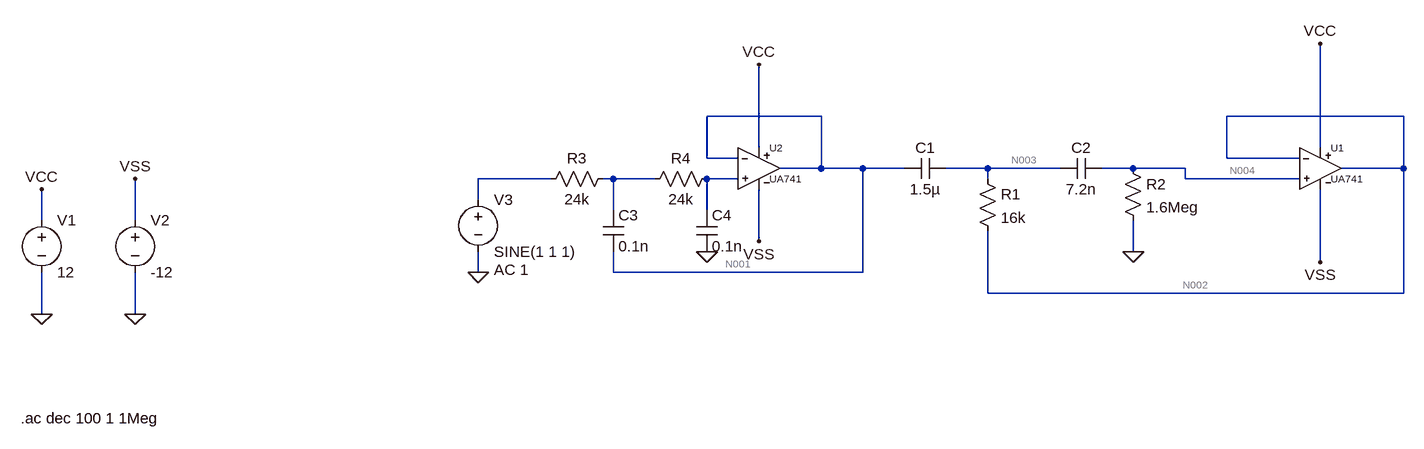
[diagram p0: schematic Filter Stage.asc]
Filter Stage.asc, the LTspice schematic file:
Version 4.1
SHEET 1 1268 680
WIRE 112 48 -64 48
WIRE 1008 48 736 48
WIRE 16 96 16 -32
WIRE 880 96 880 -64
WIRE -64 112 -64 48
WIRE -16 112 -64 112
WIRE 736 112 736 48
WIRE 848 112 736 112
WIRE 112 128 112 48
WIRE 112 128 48 128
WIRE 176 128 112 128
WIRE 240 128 176 128
WIRE 368 128 304 128
WIRE 480 128 368 128
WIRE 592 128 544 128
WIRE 672 128 592 128
WIRE 1008 128 1008 48
WIRE 1008 128 912 128
WIRE -304 144 -416 144
WIRE -208 144 -224 144
WIRE -144 144 -208 144
WIRE -16 144 -64 144
WIRE 368 144 368 128
WIRE 672 144 672 128
WIRE 848 144 672 144
WIRE -416 176 -416 144
WIRE -208 192 -208 144
WIRE -64 192 -64 144
WIRE -1088 208 -1088 160
WIRE -944 208 -944 144
WIRE 16 240 16 160
WIRE 592 256 592 208
WIRE 880 272 880 160
WIRE -416 288 -416 256
WIRE -208 288 -208 256
WIRE 176 288 176 128
WIRE 176 288 -208 288
WIRE 368 320 368 224
WIRE 1008 320 1008 128
WIRE 1008 320 368 320
WIRE -1088 352 -1088 288
WIRE -944 352 -944 288
FLAG -1088 352 0
FLAG -944 352 0
FLAG -1088 160 VCC
FLAG -944 144 VSS
FLAG -416 288 0
FLAG 16 -32 VCC
FLAG 16 240 VSS
FLAG -64 256 0
FLAG 592 256 0
FLAG 880 -64 VCC
FLAG 880 272 VSS
SYMBOL voltage -1088 192 R0
SYMATTR InstName V1
SYMATTR Value 12
SYMBOL voltage -944 192 R0
SYMATTR InstName V2
SYMATTR Value -12
SYMBOL voltage -416 160 R0
WINDOW 123 24 124 Left 2
WINDOW 39 0 0 Left 0
SYMATTR Value2 AC 1
SYMATTR InstName V3
SYMATTR Value SINE(1 1 1)
SYMBOL res -208 128 R90
WINDOW 0 0 56 VBottom 2
WINDOW 3 32 56 VTop 2
SYMATTR InstName R3
SYMATTR Value 24k
SYMBOL cap -224 192 R0
SYMATTR InstName C3
SYMATTR Value 0.1n
SYMBOL res -48 128 R90
WINDOW 0 0 56 VBottom 2
WINDOW 3 32 56 VTop 2
SYMATTR InstName R4
SYMATTR Value 24k
SYMBOL cap -80 192 R0
SYMATTR InstName C4
SYMATTR Value 0.1n
SYMBOL cap 304 112 R90
WINDOW 0 0 32 VBottom 2
WINDOW 3 32 32 VTop 2
SYMATTR InstName C1
SYMATTR Value 1.5µ
SYMBOL cap 544 112 R90
WINDOW 0 0 32 VBottom 2
WINDOW 3 32 32 VTop 2
SYMATTR InstName C2
SYMATTR Value 7.2n
SYMBOL res 352 128 R0
SYMATTR InstName R1
SYMATTR Value 16k
SYMBOL res 576 112 R0
SYMATTR InstName R2
SYMATTR Value 1.6Meg
SYMBOL UA741 208 160 R0
SYMATTR InstName U2
SYMBOL UA741 1072 160 R0
SYMATTR InstName U1
TEXT -1120 512 Left 2 !.ac dec 100 1 1Meg

The netlist it stands for:
* Filter Stage.asc
V1 VCC 0 12
V2 VSS 0 -12
V3 N005 0 SINE(1 1 1) AC 1
R3 N006 N005 24k
C3 N006 N001 0.1n
R4 N007 N006 24k
C4 N007 0 0.1n
C1 N003 N001 1.5µ
C2 N004 N003 7.2n
R1 N003 N002 16k
R2 N004 0 1.6Meg
X§U2 N007 N001 VCC VSS N001 UA741  ; pins + 2 + ? 5
X§U1 N004 N002 VCC VSS N002 UA741  ; pins + 2 + ? 5
.ac dec 100 1 1Meg
.lib LTSPICE_model_files\UA741.301
.backanno
.end

* Results of the author's LTspice run, read from the files saved beside the schematic
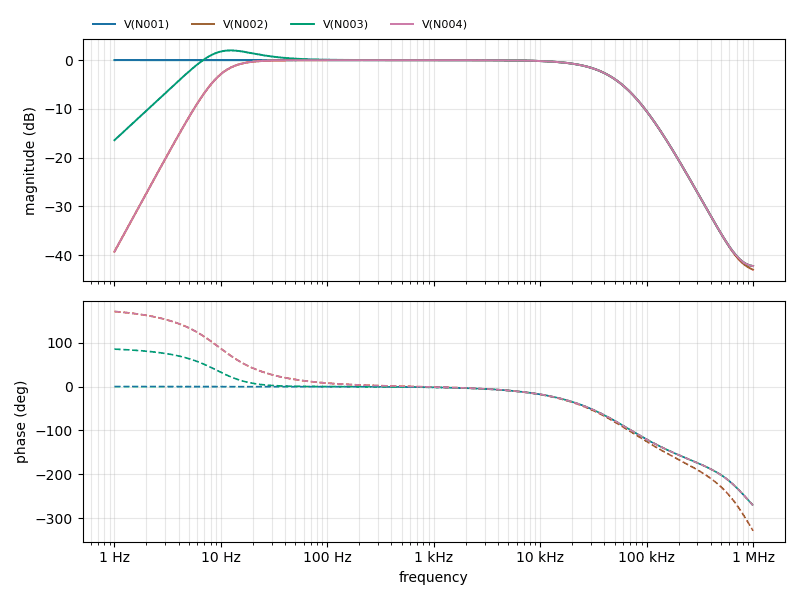
[diagram p1: AC Analysis of Filter Stage.asc, plotted from the saved traces]
* AC Analysis, 1 run:
*   V(N001): -0.00 dB at 1 Hz, -42.22 dB at 1 MHz, peak -0.00 dB at 1 Hz, 3 dB below the peak at 43.1 kHz
*   V(N002): -39.25 dB at 1 Hz, -42.96 dB at 1 MHz, peak -0.00 dB at 389 Hz, 3 dB below the peak at 9.829 Hz and 43.1 kHz
*   V(N003): -16.42 dB at 1 Hz, -42.22 dB at 1 MHz, peak 1.99 dB at 12.3 Hz, 3 dB below the peak at 5.903 Hz and 23.9 kHz
*   V(N004): -39.25 dB at 1 Hz, -42.22 dB at 1 MHz, peak -0.00 dB at 389 Hz, 3 dB below the peak at 9.829 Hz and 43.1 kHz